# Altium schematic sheet Power.SchDoc: Power
size B; DrawnBy: Jasper Yun; SheetNumber: 4; SheetTotal: 13; Competition: SAC 2021; Subteam: Avionics; University: McGill University; Location: Montreal, Quebec; Project: Avionics Project Name; MRT: McGill Rocket Team; SPICEModelCachePJLGTJJW: <root> / <DocumentId>PJLGTJJW</DocumentId> / <CacheFrame Number="0"> / <Model Name="tlv74133p_trans" Kind="CKT"> / <Text>**$ENCRYPTED_LIB / **$INTERFACE / *$ / * TLV74133P / ***************************************************************************** / * (C) Copyright 2017 Texas Instruments Incorporated. All rights reserved. / ***************************************************************************** / ** This model is designed as an aid for customers of Texas Instruments. / ** TI and its licensors and suppliers make no warranties, either expressed / ** or implied, with respect to this model, including the warranties of / ** merchantability or fitness for a particular purpose. The model is / ** provided solely on an "as is" basis. The entire risk as to its quality / ** and performance is with the customer. / ***************************************************************************** / * / ** Released by: WEBENCH Design Center, Texas Instruments Inc. / * Part: TLV74133P / * Date: 18May2017 / * Model Type: Transient / * Simulator: PSPICE / * Simulator Version: 16.2.0.s003 / * EVM Order Number: / * EVM Users Guide: / * Datasheet: / * / * Model Version: Final 1.00 / * / ***************************************************************************** / * / * Updates: / * / * Final 1.00 / * Release to Web / * / ***************************************************************************** / * Model Usage Notes: / * / * 1. The following features have been modeled / *      a. Start-up behaviour is modeled / *      b. Line transients / *      c. Load transients / *      d. Current Limit and current foldback is modeled / *      e. PSRR is modeled only till 1st pole and 1st Zero (Model limitation) / * 2. Quiescent current, noise characteristics and temperature effects are not modeled / ***************************************************************************** / *$ / .SUBCKT TLV74133P_TRANS EN IN OUT GND NC / $CDNENCSTART / eee8c5c7a2bc4b01f045f303678664e7916da0bae22e8cb0bba041dd67c69ce448ea70148a9ac1670c8926c1ac5057c8ccfcd77bf87ca9dc0b4c746fd798d26a / 3ef7762512c2728d26c880f485e2ca342a3c106b023313d28ada37d8d5c7cf52644126c9831a96bdcf2104790de72d3290ec9fe8abf7673c99208d83ebf7835e / 61f0acdd6f1a2e998d23324c429dcbc5041760c3ad23639278b54ce720b1001e7cdcf61de42ce3d848c4805203a5c137bee7ada13b64678567bea335f56363c6 / ddf70eae3b592905a60fd3951de4fe94b329d1ed4b63966290c34a02337a9a58aece49529b1f7d826366b8ad391fd706fad6b9b33c879503dcff4b786816fba0 / 90124f6cbed1c8c0706b807646b80371ffc373d0dda82e245170a8e3336487152c4b5f36edab5d85f319897185d5535e8a21efae9e307b6c3ec926314e3fefa5 / a16523cb4c600880a2f169dd7cb883443cbac3375282bfebbcfdbad4c7a0b23d9c99a6f8ecce348375963efd3ee34e16b032015482838020199902ef25e0ffab / d24b51ea77d68888aece49529b1f7d826366b8ad391fd706fad6b9b33c8795030792eeae181b1b44beb4f1549a7315f36c9d98417bdfb6664d200389545d8b40 / 4b6085f2012636678ee5eab1ce21437b9f9cefdf57bbeb6c020a790a49c0643f9ede7840fd6a39a671b3b397669e727167b79fe510296b6d91e8ee27c5f31f3a / 394197bedeb77a71acab1d0766be876c88df16e4df9fb34693c3b95748fda407020a790a49c0643f9ede7840fd6a39a671b3b397669e72712e7b2aeee83c6f3f / 3b59b36ad64eb5869e6b95464fb772f3a3420d98aed0a149c78e2b5d14e913c21bc90dac9682697462d766f77596a54b020a790a49c0643fe49a60ab4740d6b3 / 86ad213343ec82a92c4cbab0291893203ce9cec0b01d2be1d52509d1cc72a26f23b782b3d6a37df1aece49529b1f7d826366b8ad391fd706707bb47c14a771c8 / 904e90e8e5b2fbfdb9d15c5be4e02d4918754e13dba8dbd33fcc20578536d17e644126c9831a96bdcf2104790de72d3290ec9fe8abf7673c99208d83ebf7835e / 2f646e0e8d7ca9fb860341bb47536c89d3c6f4cd3b9e53669f7df7e1d853713798709113e7ea04d2b5f1c17ee79563032ae3405140756777127e59a57d0b4bc4 / bedb4c285028d3891acdef34d66cba5ce5e7fade4086c0d1994489401db0f447ceeea1f042e441ede71f71e187584171cf2104790de72d3292cbc56994fee090 / c43ca65fb3926f3b26c880f485e2ca3443e01674667ecbfe480b083f93abc69faece49529b1f7d826366b8ad391fd706fad6b9b33c879503dcff4b786816fba0 / a40072fa2b99fd1b706b807646b803712c8fce4fe11cffed06893d1f608340c31a57e3204fc8087fc96625c45fc81f376908c46321d64a826653698ee93a71da / fa68f365a2a9a9bbf60ecfe3dff4fab23ca366a40c90fa0337ed6c52b699ec9ee3e0d0e1c9fb6cda5489a2edd6e7d983dc20eb22577d8ae2e1fbebbbd8524ad9 / cdaa385411811e27bfd81d659a09e4b32637e9cac2aa5cea2cecad1ebf804c4bf467148f06ca8e432ae3405140756777db8bdcea6ac980ec0b07346d43c1325b / 6dcfb6d5e8929f04706b807646b8037110fe20894a82e47899b87aceb23e86970c7e012bffe34f9d2fd4a791317eac01020a790a49c0643fe49a60ab4740d6b3 / 311fb123761f1dd1da8e99d2e05d980afe5c5a072de24811d018ce536f72a8d458b58148317651d22ae3405140756777db8bdcea6ac980ec0b07346d43c1325b / 54653036f112a7e5706b807646b803710e1d0d69cc09017f008dd3578f4a1956bda456e8ba5dde02653b5dcfa0c8c8ae042f0c0c78bb0debad96429cd927e3a7 / 2671091ba70d1568706b807646b80371cbbc9b9c51ccb6540e1d0d69cc09017fa14066b181bb1058427faca47da832a8eccdbc9c173b71e03c54c8fdce812e4c / 593efcd58d475ce138380075bb5248d8aece49529b1f7d826366b8ad391fd706fad6b9b33c8795030792eeae181b1b44beb4f1549a7315f3506f5ad464cab33d / cdaa385411811e27bfd81d659a09e4b32637e9cac2aa5cea2cecad1ebf804c4bf467148f06ca8e432ae3405140756777db8bdcea6ac980ec0b07346d43c1325b / a5d158a0fc11634f706b807646b80371c1d303cdb19fdcef2b9fd23fad97521a56bfede5d11cc7cabee7ada13b646785310b69cdc84fed8f27c911ef3c5c498a / 8df0563ff6b12bcb706b807646b80371c40db3808310b1468d5aa40cb2332d6f855e487a2800314b2ae3405140756777db8bdcea6ac980ec0b07346d43c1325b / 5aa875be979324eb706b807646b8037106893d1f608340c31325fee8f24ce546e71f71e187584171cf2104790de72d3290ec9fe8abf7673c99208d83ebf7835e / 07b8b607253a07a2706b807646b80371e560c959dcca8cd625a084edf9a537bf00877b91cd4279f39377af7e54bb163f9e3e4f75c74b8b1af6c8b208a55c3008 / a3ce589fda26bc39706b807646b803710e1d0d69cc09017f90443e65e9b1b54d83463dd640f012e500d3e0b087c73744bee7ada13b64678567bea335f56363c6 / 4130590ac940df72706b807646b8037195cfd33ccd56f2c7aef5faa9b9d114588de691ddd4293588a32a9f5de4fdf71d60a188d940e604c1ecf22f43cd602b91 / 44286f328a01b55967d2eff95da562744c592bb4da2fa1a8ba08f13bb18f92410cf73d710652a1dc7964efbac1c526ebe8eb3dc18225a2878829e4def662fa7c / 4b6085f2012636678ee5eab1ce21437bcb394d09edfe67a62c4b5f36edab5d85f319897185d5535e8a21efae9e307b6c39aef95345115d28fb7b3c5aa7521e2a / 6dcc2999c2dfe559706b807646b803715848080d04576310931deb2ad43d855bdaf6279e60479f513ca366a40c90fa0337ed6c52b699ec9ead65093cc772bc07 / 0be1bd08545f4ec3706b807646b803719b4317da4cfba3b11a36b4f98b9d0a824c592bb4da2fa1a8ba08f13bb18f92410cf73d710652a1dc857994194d945adf / 385bb969478bc1fd7509c136893a3e2e2688e0dfc494de0fa05c5098b4f2d71d6790562ac97fa9372b39496d8eed4513192fb0130cd26ef2491c3f072e96755f / 33b35530770e96c3020a790a49c0643f9ede7840fd6a39a671b3b397669e727167b79fe510296b6d7fc7fe1724ee00a8e5b73a7f8e9611b36957c72a5f702f99 / 6700a2a6ef061025e5db8de19cca6808da00941f567143647ec4baa2e3f12776b5f1c17ee79563032ae3405140756777db8bdcea6ac980ec0b07346d43c1325b / 69ff18044fae7c89706b807646b803710e1d0d69cc09017f83db50ce616e99681d4e452fee093da42ae3405140756777db8bdcea6ac980ec0b07346d43c1325b / 6bc6bcfc0cf717f3706b807646b803710e1d0d69cc09017f9f6f26d8292ed07737a6a454c38136f2bee7ada13b646785310b69cdc84fed8f27c911ef3c5c498a / 02dac6cba784505e706b807646b80371e13768767d1ad4df6d2099228887f927c7b3ca07e03285463e67e48cb17c169bf357d2495314aea2abb485c8ac7a39ac / 9e700d1bd10bd6d1706b807646b80371ed5711e40d45802b61698dfbf8657ce6fec09a3dc3f5b4bc66d837958b36832c4c592bb4da2fa1a8f7aec25d7f708173 / f28257b2a3730294706b807646b80371c1d303cdb19fdcef2b9fd23fad97521a5699b53886fa29b6bee7ada13b646785310b69cdc84fed8f27c911ef3c5c498a / e9f419af62bfe95ebc27f931268b4061819f482ced2d14da2c71c45202431155ce5ec34e6f8ad1cac13ffc8b6ae5cb2e4a2edc29a53e23e5909669e0b73a8f95 / 5d078000650a8fa5fdb2fa9c3b6939f20665193f98f36aacffec3124ac57d11d8675a01b2db95be7bee7ada13b646785310b69cdc84fed8f27c911ef3c5c498a / e9f419af62bfe95ecc0121b5e20e2076819f482ced2d14dab26871b2b1938100ce5ec34e6f8ad1cac1550d7a244ac219a4daa95c07252e71d38aff4e12555a5d / 0a74212461f65cb941623afbc4370720e6de3ee6a0c7ca59294ff995b8f67f653ca366a40c90fa0337ed6c52b699ec9ee3e0d0e1c9fb6cda153de17b096719c0 / bc8ee2299b220803beda7935c8aeca8d90d894e251243331dc0745283a910a9d4c592bb4da2fa1a8ba08f13bb18f92410cf73d710652a1dc857994194d945adf / e9f419af62bfe95edca29065f7b4a684696ce76c04a2281e749d13634498f34b6f49004d18e3f79a6e50180630c94e30a0dc0d49a7822e99d164c99c042b1bf7 / 6ac9a0759edf463767088d86df747f60bee7ada13b646785310b69cdc84fed8fd2644a0c7a1f6653715e1eef0b72abfaeada256628d9fa61a787a16be87366e6 / 8567fa61d0589ca2c1fb5ea162ffd514e71f71e187584171cf2104790de72d3290ec9fe8abf7673c970e3472bd46494a4e473918de3a7445e2df95f2ca454947 / afe317ae10e98155a2f169dd7cb88344fc17600d62a6be62651ce840812926c2a0037b483206f0537704591a7ab83b388b76e1023bea0c1650794576b4f63d0d / 5e907deffd12c5ffdd06c2baef735cae36806a8e381bf9a0cf2104790de72d3290ec9fe8abf7673c970e3472bd46494a4e473918de3a7445e2df95f2ca454947 / 8767f397bff4c3a731bbfa71d5efb6fe825b843a3aa9ddcdbee7ada13b646785310b69cdc84fed8fd2644a0c7a1f6653715e1eef0b72abfa55f88976ddff33c2 / bcd47878fdf46051706b807646b80371e71d04604f91d63b8492e52ca9907137c32e32cca6618f9fbba78e549769b5b6a2b4ff936e38a05e5ba162f215351813 / e6a326a14082b2f49de538e0e17f3b612cb13c1144feac5836fb420f5a067a1e020a790a49c0643f9ede7840fd6a39a671b3b397669e72712e7b2aeee83c6f3f / 065d26286aaf2f122531ce9df5eb0603cdb79a754752616577946fa90ac97f1623b782b3d6a37df1aece49529b1f7d826366b8ad391fd706707bb47c14a771c8 / 81bc0cb7c12452449e6b95464fb772f30fee6b11c20909b67a1e30009c1ce0bb97d0bdc16e1372b18dcea2cdd2d3d5cc9783ae8e4821c68fb9549840541e7e65 / 2b1410deca799d73020a790a49c0643f9ede7840fd6a39a671b3b397669e727167b79fe510296b6d7fc7fe1724ee00a8e5b73a7f8e9611b36957c72a5f702f99 / 4b6085f2012636678ee5eab1ce21437bcb394d09edfe67a62c4b5f36edab5d85f319897185d5535e8a21efae9e307b6c39aef95345115d28fb7b3c5aa7521e2a / 81a9746d786d11d64597b28a3abd988012ddce7625ce8b749a817b57fafd1477b796b84db146c932d2bbd7e847d638e1e776e9b255bda08c8cc849879194c8ab / 021166ac3753b7b82c4b5f36edab5d85f319897185d5535e8a21efae9e307b6c39aef95345115d28a4e86a2b8ce1a15c876aa96db62f570e4728da9b5d57d060 / 4b6085f2012636675a0aa31c52cddba976617f42cd5d956bcf2104790de72d3290ec9fe8abf7673c970e3472bd46494a4e473918de3a7445e2df95f2ca454947 / fe9073afece57ff8706b807646b80371840b46a3c196863a8492e52ca9907137c32e32cca6618f9fe2b513f28f5cc45e8ae977c83ed93ca01a4b3a4aa1a53d39 / b5f1c17ee79563032ae3405140756777db8bdcea6ac980ec33aa61ed5dfd1615a2b953758ae0653997413343c5173f709a7fe0de77cfb358e852ad9deb7e5829 / 171d979aaf3d706b8036d105784414182421587c0f57824df28c20f9309a199907f8501aec60f8d72c4b5f36edab5d85f319897185d5535ea3db9509eaaedb86 / 62748d827ca277c7706b807646b80371f8483db7077f00d88492e52ca9907137c32e32cca6618f9f3f95ac6a6abeffa557ca4629d8e4d1d5c706f9f16c578ebd / 9a5ec75040f406dfaece49529b1f7d826366b8ad391fd706fad6b9b33c8795030792eeae181b1b44beb4f1549a7315f36c9d98417bdfb6664d200389545d8b40 / dcebf7f9574ab91a6d2aa86b77a26c95b5f1c17ee79563032ae3405140756777db8bdcea6ac980ec33aa61ed5dfd1615a2b953758ae06539f0d4404e9eae4543 / c9df73872fc60450f79767d8efdc77048036d10578441418c3b36018e345e16ea9d370a6c76a86b1c95c6e3ee2b90bc64c592bb4da2fa1a8f7aec25d7f708173 / 2a76c18f665e8c272c4cbab029189320d042b92eba138a7c9f7df7e1d8537137dc26028ef70590f4b5f1c17ee79563032ae3405140756777127e59a57d0b4bc4 / b052355e65d40bda4d945ab16ce19c1c84ddacec780ae998d1329743685553f552abd955e62c0758641d3019da38fe062ae3405140756777127e59a57d0b4bc4 / 316c4e958281b805388657e9d51604f7d042b92eba138a7c9f7df7e1d85371374e5ddb18d203799eb5f1c17ee79563032ae3405140756777127e59a57d0b4bc4 / 93d3808648446fd760c210771409cb2e6d636f62dc811967b531fdb8889633b4bf1ee911780421dd2ae3405140756777db8bdcea6ac980ec0b07346d43c1325b / abc05a84349f7fe5c4a87854647e1c4d7a2cf28d9fad6470b68795307ca378132c4b5f36edab5d85f319897185d5535e8a21efae9e307b6c3ec926314e3fefa5 / d674c3790d07122b11a38be6e728d86571fdfa3b9479815f35cddce08a7c8e49aad0cae5ebf3019acf2104790de72d3290ec9fe8abf7673c99208d83ebf7835e / 98b5f0d56fa74586371dd2737e0b85bb17699167bed26af3ef0469327ad2d651c070e39803c5b7f2644126c9831a96bdcf2104790de72d3292cbc56994fee090 / 560bc4dfcba57a2c4597b28a3abd9880546126e99c25f83666eaeb9fc4cc8ae1a506802e3014c1ec3efcea856e03cbcb020a790a49c0643fe49a60ab4740d6b3 / 635adb6c201b6ba1dc5a1b22284dea7f7269e4f26708c1f5e15414253a7581d723b782b3d6a37df1aece49529b1f7d826366b8ad391fd706707bb47c14a771c8 / 04f5acd939422ec02fbfcc2b872ff946c84ddf640b93507bce5ec34e6f8ad1ca6e02cd619ff2cf87bba78e549769b5b69df1af93d6544d48084e1162bd10742f / 8f87abf34a7ecbdc37080f586b2fbb9f644126c9831a96bdcf2104790de72d3290ec9fe8abf7673c970e3472bd46494a4e473918de3a7445e2df95f2ca454947 / 3e2f6d3b6fa1f79ebee7ada13b646785310b69cdc84fed8fd2644a0c7a1f6653715e1eef0b72abfaeada256628d9fa6105ada24893efbf7db502a1ba211b9cf5 / e83d563d614d5ce9a2f169dd7cb88344dd754eba74fd38c68cd7aeb0417ec42b478a87bc5b8e6cf92c4b5f36edab5d85f319897185d5535ea3db9509eaaedb86 / 9afa1f10a7f457ea9c68ca010600ec3f08ae2aac6c0aefcf5fa3b0d8aac7c8ab64bcc0a497fc04ba3ca366a40c90fa0337ed6c52b699ec9ead65093cc772bc07 / 102778d1f868b7a49e6b95464fb772f3f67259042900919200877b91cd4279f3e858241bec91ac5932f4f6e343e2740ce71f71e1875841710bbd919f40ea0a91 / 7aff1ed17501806211a38be6e728d865dae2ce7659f8ae488431538b2a67818faece49529b1f7d826366b8ad391fd706fad6b9b33c879503dcff4b786816fba0 / 5c2e262d493b312fa7aa53100c9e1bbea947b049e5632dc590449a6411b06b9bddaaa86168801b89710f626c2faf14a62ae3405140756777127e59a57d0b4bc4 / b0eb42ca922cce592fbfcc2b872ff94636ea5db477834f11ce5ec34e6f8ad1ca4a00a148cfaed3410d0123120ac936d82594fc6756c8b3f583a3a146f650f598 / 39438c6af260813937080f586b2fbb9f644126c9831a96bdcf2104790de72d3290ec9fe8abf7673c970e3472bd46494a4e473918de3a7445e2df95f2ca454947 / 3e2f6d3b6fa1f79ebee7ada13b646785310b69cdc84fed8fd2644a0c7a1f6653715e1eef0b72abfaeada256628d9fa6105ada24893efbf7db502a1ba211b9cf5 / 240cf6a83072ff1ac71f2ec08efb7527e669cd180bf3e26a3cafa1326cfe1874949d6e4437d829a1bf659a476171f3dc4c592bb4da2fa1a8f7aec25d7f708173 / 311fb123761f1dd129c75dcdf45ee2c9184d51289dba83b9873e8e5ec9278a4fdd037aafe640141b53af89050c52dda0986d8eb4dc61f09ccd81523dba430406 / 857620ce20ef86cb26c880f485e2ca343bb1a3b1207c1c81ec673e334d6e7ccd24fdfd9bb2e10b073ca366a40c90fa0337ed6c52b699ec9ead65093cc772bc07 / e0bee0f3fadd672460c210771409cb2e6d636f62dc811967f24bf58ddadd36c75fbceec05a2e4b3f7d7f15953a32e2dc2c4b5f36edab5d8551199e6b857bd9bb / 705d459f50f7a08ca2f169dd7cb88344af02b8d90c64a20083463dd640f012e500d3e0b087c73744bee7ada13b646785310b69cdc84fed8f27c911ef3c5c498a / 23ee73d6065f364126c880f485e2ca34bb994c8b62ecb3d556bfede5d11cc7cabee7ada13b646785310b69cdc84fed8fd2644a0c7a1f66532b9d75a20e81bbc9 / 5ff44a992c4e2ee3dc5a1b22284dea7f22619596979187a5def26a02973838a2aece49529b1f7d826366b8ad391fd706fad6b9b33c879503dcff4b786816fba0 / 3bdfb3bcf8540f57c4a87854647e1c4d5d8a3d237bfb39ae1de333fbd2e0f35d2ae3405140756777db8bdcea6ac980ec33aa61ed5dfd1615938a028feea6b6ab / 8f10d309634521e54597b28a3abd9880ebd3a03647eb9b9894002bb68e8267dd50932f91c29cb99b710f626c2faf14a62ae3405140756777127e59a57d0b4bc4 / c0ff0c48b49f7f339e6b95464fb772f30aba9e7e21195c650903cac0925c6772478a87bc5b8e6cf92c4b5f36edab5d85f319897185d5535ea3db9509eaaedb86 / 0dea85bdd2f6170572244c37edb8c9a57c97cea512c6127aa1a283936dd7cb703ca366a40c90fa0337ed6c52b699ec9ee3e0d0e1c9fb6cda153de17b096719c0 / b8b56863f55c875e94fbbbfac28a5c5cb686a80b117e185d78b54ce720b1001e5702f8045be5988d48c4805203a5c137bee7ada13b64678567bea335f56363c6 / b90e0c5fe970b38760c210771409cb2ef939b0ee93e9a0c2fd398b77382f2c3d5fa3b0d8aac7c8abe7974be90fc4014564bcc0a497fc04bab2a3b9742409977c / 48a94d11d238250fc31b79b9fb81119cccb2db67557ffe5198d4cacdd01bc2de3ac5545db54f890b3f15d752ad08f63f020a790a49c0643fe49a60ab4740d6b3 / 717cdf892ff6b6ffa60fd3951de4fe94f62cc45356863029bf1ee911780421dd2ae3405140756777db8bdcea6ac980ec33aa61ed5dfd1615938a028feea6b6ab / 615a28c46d723740a2f169dd7cb88344d1eba1bd85eddbc90a0ec22218277ba4bf1ee911780421dd2ae3405140756777db8bdcea6ac980ec0b07346d43c1325b / f80a395284a571112fbfcc2b872ff946e00e80a1258e7bf6ce5ec34e6f8ad1caa70718c54ca105391764c88c178ac69b6d2aa86b77a26c951aabfa10941d45cf / 2cfd781695004e380b22971992301099af875caab1306b6ed124cb96fac5ac60a3afba3b2717dabc3e61460e307bde4710af332b9667bcfad020173982ed1cba / 9a45d9d494e43254a129f2477c5055a1bee7ada13b646785310b69cdc84fed8fd2644a0c7a1f6653715e1eef0b72abfaeada256628d9fa61a787a16be87366e6 / 62de40c9486cbee4fdd8918a90e8c397bd1f26a14863c7ed23463771f33aae2813aa0fddd8a96f49efe85a592a0b5b6a8ad03f6ac88933cd16df2a1bd2dfca10 / $CDNENCFINISH / .ends TLV74133P_TRANS</Text> / </Model> / </CacheFrame> / </root>
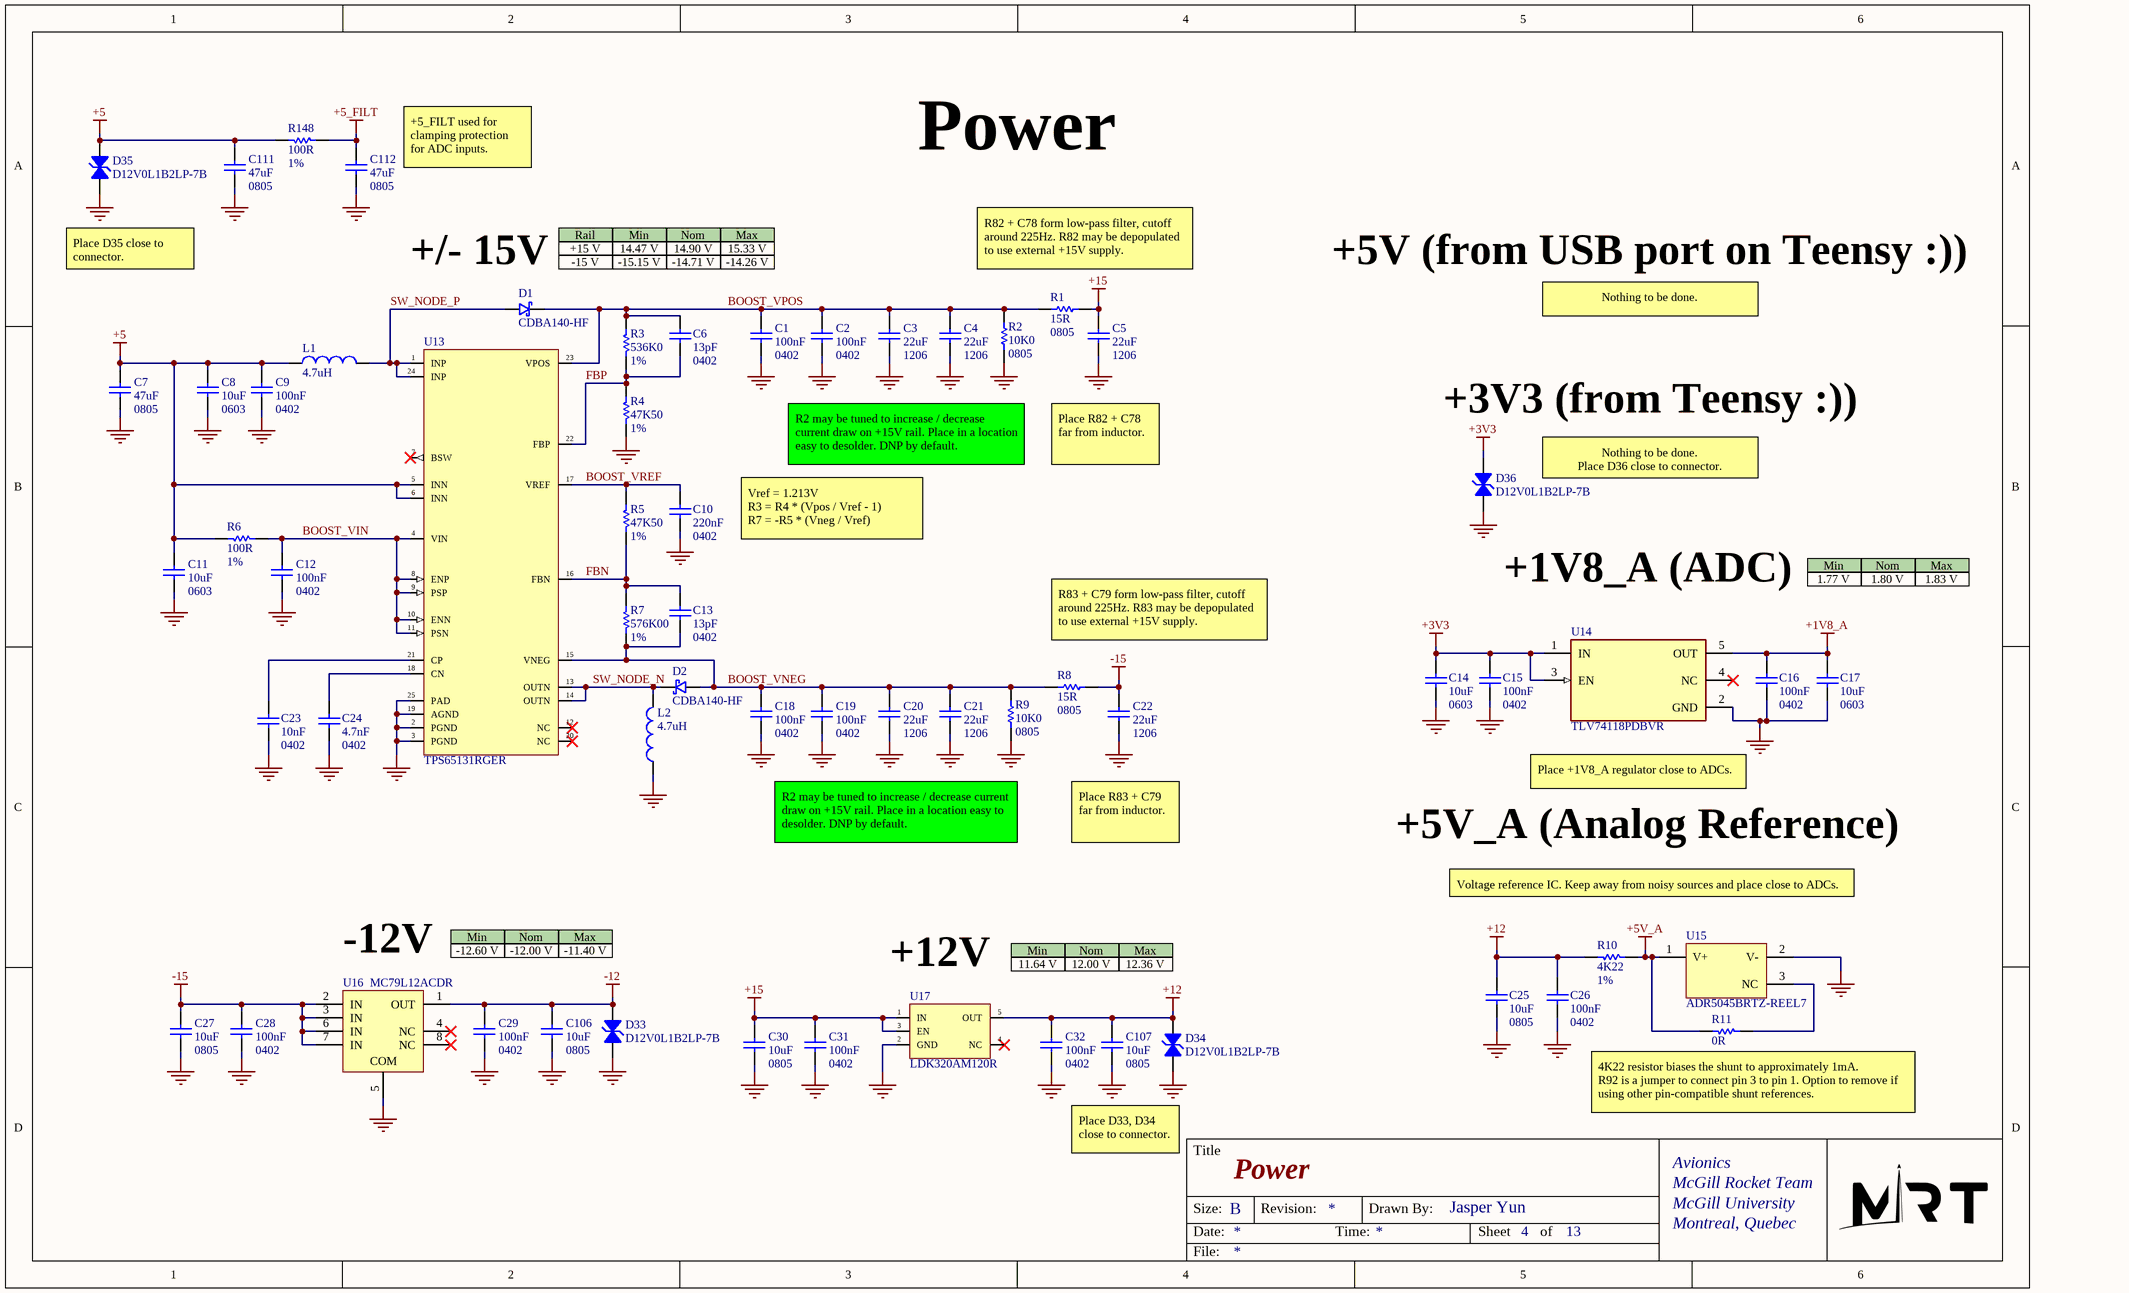
[diagram p0: Power.SchDoc]

## Parts
C1  100nF  value 0402  [0402 CAP]
C2  100nF  value 0402  [0402 CAP]
C3  22uF  value 1206  [1206 CAP]
C4  22uF  value 1206  [1206 CAP]
C5  22uF  value 1206  [1206 CAP]
C6  13pF  value 0402  [0402 CAP]
C7  47uF  value 0805  [0805 CAP]
C8  10uF  value 0603  [0603 CAP SAMSUNG CL10C]
C9  100nF  value 0402  [0402 CAP]
C10  220nF  value 0402  [0402 CAP]
C11  10uF  value 0603  [0603 CAP SAMSUNG CL10C]
C12  100nF  value 0402  [0402 CAP]
C13  13pF  value 0402  [0402 CAP]
C14  10uF  value 0603  [0603 CAP SAMSUNG CL10C]
C15  100nF  value 0402  [0402 CAP]
C16  100nF  value 0402  [0402 CAP]
C17  10uF  value 0603  [0603 CAP SAMSUNG CL10C]
C18  100nF  value 0402  [0402 CAP]
C19  100nF  value 0402  [0402 CAP]
C20  22uF  value 1206  [1206 CAP]
C21  22uF  value 1206  [1206 CAP]
C22  22uF  value 1206  [1206 CAP]
C23  10nF  value 0402  [0402 CAP]
C24  4.7nF  value 0402  [0402 CAP]
C25  10uF  value 0805  [0805 CAP]
C26  100nF  value 0402  [0402 CAP]
C27  10uF  value 0805  [0805 CAP]
C28  100nF  value 0402  [0402 CAP]
C29  100nF  value 0402  [0402 CAP]
C30  10uF  value 0805  [0805 CAP]
C31  100nF  value 0402  [0402 CAP]
C32  100nF  value 0402  [0402 CAP]
C106  10uF  value 0805  [0805 CAP]
C107  10uF  value 0805  [0805 CAP]
C111  47uF  value 0805  [0805 CAP]
C112  47uF  value 0805  [0805 CAP]
D1  CDBA140-HF  [Diode SMA]
D2  CDBA140-HF  [Diode SMA]
D33  D12V0L1B2LP-7B  [DFN1006-2]
D34  D12V0L1B2LP-7B  [DFN1006-2]
D35  D12V0L1B2LP-7B  [DFN1006-2]
D36  D12V0L1B2LP-7B  [DFN1006-2]
L1  4.7uH  [Inductor BWVS005050403R3M00]
L2  4.7uH  [Inductor BWVS005050403R3M00]
R1  15R  value 0805  [0805 RES]
R2  10K0  value 0805  [0805 RES]
R3  536K0  value 1%  [0402 RES]
R4  47K50  value 1%  [0402 RES]
R5  47K50  value 1%  [0402 RES]
R6  100R  value 1%  [0402 RES]
R7  576K00  value 1%  [0402 RES]
R8  15R  value 0805  [0805 RES]
R9  10K0  value 0805  [0805 RES]
R10  4K22  value 1%  [0402 RES]
R11  0R  [0402 RES]
R148  100R  value 1%  [0402 RES]
U13  TPS65131RGER  [VQFN-24]
U14  TLV74118PDBVR  [FP-DBV0005A-IPC_A]
U15  ADR5045BRTZ-REEL7  [ADI-RT-3_M]
U16  MC79L12ACDR  [D0008A_M]
U17  LDK320AM120R  [SOT23-5]

## Nets
+1V8_A: C16.2 C17.2 U14.5(OUT)
+3V3: C14.2 C15.2 D36.2 U14.1(IN) U14.3(EN)
+5: C7.2 C8.2 C9.2 C11.2 C111.2 D35.2 L1.1 R6.1 R148.1 U13.5(INN) U13.6(INN)
+5_FILT: C112.2 R148.2
+5V_A: R10.2 R11.1 U15.1(V+)
+12: C25.2 C26.2 C32.2 C107.2 D34.2 R10.1 U17.5(OUT)
+15: C5.2 C30.2 C31.2 R1.1 U17.1(IN) U17.3(EN)
-12: C29.2 C106.2 D33.2 U16.1(OUT)
-15: C22.2 C27.2 C28.2 R8.1 U16.2(IN) U16.3(IN) U16.6(IN) U16.7(IN)
GND: C1.1 C2.1 C3.1 C4.1 C5.1 C7.1 C8.1 C9.1 C10.2 C11.1 C12.1 C14.1 C15.1 C16.1 C17.1 C18.1 C19.1 C20.1 C21.1 C22.1 C23.1 C24.1 C25.1 C26.1 C27.1 C28.1 C29.1 C30.1 C31.1 C32.1 C106.1 C107.1 C111.1 C112.1 D33.1 D34.1 D35.1 D36.1 L2.1 R2.1 R4.2 R9.1 U13.2(PGND) U13.3(PGND) U13.19(AGND) U13.25(PAD) U14.2(GND) U15.2(V-) U16.5(COM) U17.2(GND)
BOOST_VIN: C12.2 R6.2 U13.4(VIN) U13.8(ENP) U13.9(PSP) U13.10(ENN) U13.11(PSN)
BOOST_VNEG: C13.1 C18.2 C19.2 C20.2 C21.2 D2.2(Anode) R7.1 R8.2 R9.2 U13.15(VNEG)
BOOST_VPOS: C1.2 C2.2 C3.2 C4.2 C6.1 D1.1(Cathode) R1.2 R2.2 R3.1 U13.23(VPOS)
BOOST_VREF: C10.1 R5.1 U13.17(VREF)
FBN: C13.2 R5.2 R7.2 U13.16(FBN)
FBP: C6.2 R3.2 R4.1 U13.22(FBP)
SW_NODE_N: D2.1(Cathode) L2.2 U13.13(OUTN) U13.14(OUTN)
SW_NODE_P: D1.2(Anode) L1.2 U13.1(INP) U13.24(INP)
NetC23_2: C23.2 U13.21(CP)
NetC24_2: C24.2 U13.18(CN)
NetR11_2: R11.2 U15.3(NC)

Not connected (* = marked no-connect by the designer): U13 7(BSW)* 12(NC)* 20(NC)*; U14 4(NC)*; U16 4(NC)* 8(NC)*; U17 4(NC)*

## Notes on the sheet
- (near C112) +5_FILT used for clamping protection for ADC inputs.
- Rail
- Min
- Nom
- Max
- Place D35 close to connector.
- (near D1) +/- 15V
- +15 V
- -15 V
- 14.47 V
- -15.15 V
- 14.90 V
- -14.71 V
- 15.33 V
- -14.26 V
- R82 + C78 form low-pass filter, cutoff around 225Hz. R82 may be depopulated to use external +15V supply.
- +5V (from USB port on Teensy :))
- Nothing to be done.
- +3V3 (from Teensy :))
- R2 may be tuned to increase / decrease current draw on +15V rail. Place in a location easy to desolder. DNP by default.
- Place R82 + C78 far from inductor.
- Nothing to be done.
  Place D36 close to connector.
- Vref = 1.213V
  R3 = R4 * (Vpos / Vref - 1)
  R7 = -R5 * (Vneg / Vref)
- R83 + C79 form low-pass filter, cutoff around 225Hz. R83 may be depopulated to use external +15V supply.
- +1V8_A (ADC)
- 1.77 V
- 1.80 V
- 1.83 V
- Place R83 + C79 far from inductor.
- Place +1V8_A regulator close to ADCs.
- +5V_A (Analog Reference)
- Voltage reference IC. Keep away from noisy sources and place close to ADCs.
- (near U16) -12V
- -12.60 V
- -12.00 V
- -11.40 V
- (near U17) +12V
- 11.64 V
- 12.00 V
- 12.36 V
- (near R11) 4K22 resistor biases the shunt to approximately 1mA.
  R92 is a jumper to connect pin 3 to pin 1. Option to remove if using other pin-compatible shunt references.
- Place D33, D34 close to connector.
- Title
- Size:
- Date:
- B
- Revision:
- Time:
- Drawn By:
- Sheet
- of
- File:

## Library data of the parts
C1-C32 C106 C107 C111 C112 = Cap: Capacitor; Published: 8-Jun-2000; LatestRevisionDate: 17-Jul-2002; LatestRevisionNote: Re-released for DXP Platform.; PackageReference: RAD-0.3; Publisher: Altium Limited; PackageDescription: Radial Cap, Thru-Hole; 2 Leads; 0.3 in Pin Spacing
D1 D2 = Schottky Diode: Generic Schottky Diode
D33-D36 = Diode Zener Bidirectional: Bidirectional Zener diode
L1 L2 = Inductor: 4.7uH  BWVS005050404R7M00; Code_IEC: 1005; Published: 8-Jun-2000; LatestRevisionDate: 29-May-2009; LatestRevisionNote: IPC-7351 Footprint Added.; PackageReference: 0402-A; Publisher: Altium Limited; PackageDescription: Chip Inductor; Code_JEITA: 0402; Value: Value
R1-R10 R148 = Res1: Resistor; Published: 8-Jun-2000; LatestRevisionDate: 17-Jul-2002; LatestRevisionNote: Re-released for DXP Platform.; PackageReference: AXIAL-0.3; Publisher: Altium Limited; PackageDescription: Axial Device, Thru-Hole; 2 Leads; 0.3 in Pin Spacing
R11 = Res1: Resistor; Value: 1%; Published: 8-Jun-2000; LatestRevisionDate: 17-Jul-2002; LatestRevisionNote: Re-released for DXP Platform.; PackageReference: AXIAL-0.3; Publisher: Altium Limited; PackageDescription: Axial Device, Thru-Hole; 2 Leads; 0.3 in Pin Spacing
U13 = Dual Boost TPS65131RGER: IC REG BUCK BST INV ADJ DL 24QFN; Manufacturer: Texas Instruments; Output Voltage: 15V; Output Current: 1.95A; Operating Supply Voltage: 5.5V; Number of Outputs: 2; Efficiency: 85%; Switching Frequency: 1.4MHz; Min Input Voltage: 2.7V; Synchronous Rectifier: No; Min Output Voltage: -15V; Quiescent Current: 500uA; Topology: Buck-Boost; Output Type: Adjustable; Supplier 1: Digi-Key; Manufacturer Part Number: TPS65131RGER; RoHS: Yes; Category: Voltage Regulators - Switching; Stock 1: 7644; Pricing 1: 1=3.00000, 10=2.69400, 25=2.54720, 100=2.20760, 250=2.09436, 500=1.87926, 1000=1.70880 (USD); Case/Package: VQFN EP; Number of Pins: 24; Weight: 0.001524oz; Min Operating Temperature: -40°C; Max Operating Temperature: 85°C; Package Quantity: 3000; Packaging: Tape and Reel; Series: -; Max Input Voltage: 5.5V; Max Output Voltage: 15V; Radiation Hardening: No; Lead Free: Lead Free; RoHS Compliant: Yes; ComponentLink1URL: https://datasheet.ciiva.com/4119/40762122s8213930n7713-4119696.pdf?src-supplier=Arrow+Electronics; ComponentLink1Description: https://datasheet.ciiva.com/4119/40762122s8213930n7713-4119696.pdf?src-supplier=Arrow+Electronics; ComponentLink2URL: https://datasheet.ciiva.com/14378/tps65130-14378346.pdf?src-supplier=Avnet; ComponentLink2Description: https://datasheet.ciiva.com/14378/tps65130-14378346.pdf?src-supplier=Avnet; ComponentLink3URL: https://datasheet.ciiva.com/15223/getdatasheetpartid-254483-15223079.pdf?src-supplier=Verical; ComponentLink3Description: https://datasheet.ciiva.com/15223/getdatasheetpartid-254483-15223079.pdf?src-supplier=Verical; ComponentLink4URL: https://datasheet.ciiva.com/2035/tps65130-2035332.pdf?src-supplier=Digi-Key; ComponentLink4Description: https://datasheet.ciiva.com/2035/tps65130-2035332.pdf?src-supplier=Digi-Key; Supplier Part Number 1: 296-41760-1-ND
U14 = CMP-04917-000111-2: None; Output Configuration: Positive; Number of Regulators: 1; Quiescent Current: 50uA; Max Input Voltage: 5.5V; Dropout Voltage: 695mV; Output Type: Fixed; Power Supply Rejection Ratio (PSRR): 55dB; Max Supply Current: 75uA; Output Current: 150mA; Min Output Voltage: 1.8V; Packaging: Cut Tape; Mount: Surface Mount; Max Operating Temperature: 125°C; Case/Package: SOT-23-5; RoHS Compliant: Yes; Min Operating Temperature: -40°C
U15 = CMP-0784-00426-1: Precision Micropower Shunt Mode Voltage Reference, 5 V Output, Industrial, 3-pin SOT23 (RT-3), Reel; Manufacturer: Analog Devices; Vout: 5V; Ref Out TC (ppm/C): 10; PackageVersion: 011909-C, 02/2009; Packing: Reel; PartNumber: ADR5045BRTZ-REEL7; ComponentLink4URL: Product URL:http://www.analog.com/en/special-linear-functions/voltage-references/adr5045/products/product.html; Code_JEDEC: TO-236-AB; Mounting Technology: Surface Mount; ComponentLink4Description: URL Link1; ComponentLink2Description: Datasheet; ComponentLink1Description: Manufacturer URL; ComponentLink2URL: http://www.analog.com/static/imported-files/data_sheets/ADR5040_5041_5043_5044_5045.pdf; Operating Temp Range: -40 to 125 degC; DatasheetVersion: Rev. B; ComponentLink3URL: http:/www.analog.com/static/imported-files/packages/PKG_PDF/SOT-23-3 (RT)/RT_3.pdf; ComponentLink3Description: Package Specification; PackageReference: RT-3; PackageDescription: 3-Pin Small Outline Transistor Package, Body 2.9 x 1.3 mm, Pitch 0.96 mm; ComponentLink1URL: http://www.analog.com/en/index.html
U16 = CMP-0324-00120-3: Fixed Regulator with -14.5 to -27 V Input and -12 V Output, 0 to 125 degC, 8-Pin SOIC (D), Green (RoHS & no Sb/Br); Manufacturer: Texas Instruments; Iout(Max)(A): 0.1; Iq(Typ)(mA): 6.5; Code_JEDEC: MS-012AA; PackageReference: D0008A; ComponentLink3Description: URL Link1; Vin(Max)(V): -27; DatasheetVersion: SLVS011D; Eco-Plan: Green (RoHS & no Sb/Br); Vin(Min)(V): -14.5; PackageVersion: revM, Jun-2011; PackageDescription: 8-Pin Plastic Small Outline Integrated Circuit, 4.9 x 3.9 mm, Pitch 1.27 mm Pitch; ComponentLink2Description: Package Specification; Vout(Min)(V): -12; ComponentLink1Description: Datasheet; Mounting Technology: Surface Mount; PartNumber: MC79L12ACDR; Vout(Max)(V): -12; ComponentLink1URL: http://www.ti.com/general/docs/lit/getliterature.tsp?genericPartNumber=MC79L12A&fileType=pdf; ComponentLink2URL: http://www.ti.com/litv/pdf/msoi002j; ComponentLink3URL: Samples URL:http://www.ti.com/product/mc79l12a#samples
U17 = VREG Linear LDK320AM120R: 200 mA low quiescent current and high PSRR voltage regulator; Manufacturer: STMicroelectronics; Supplier 1: Newark; Manufacturer Part Number: LDK320AM120R; RoHS: Yes; Stock 1: 5882; Pricing 1: 1=0.95600, 10=0.85600, 25=0.81200, 50=0.73900, 100=0.66700, 250=0.62400, 500=0.55100, 1000=0.43800 (USD); RoHS Compliant: Yes; ComponentLink1URL: https://www.st.com/resource/en/datasheet/ldk320.pdf?src-supplier=Digi-Key; ComponentLink1Description: https://www.st.com/resource/en/datasheet/ldk320.pdf?src-supplier=Digi-Key; Supplier Part Number 1: 84AC1852